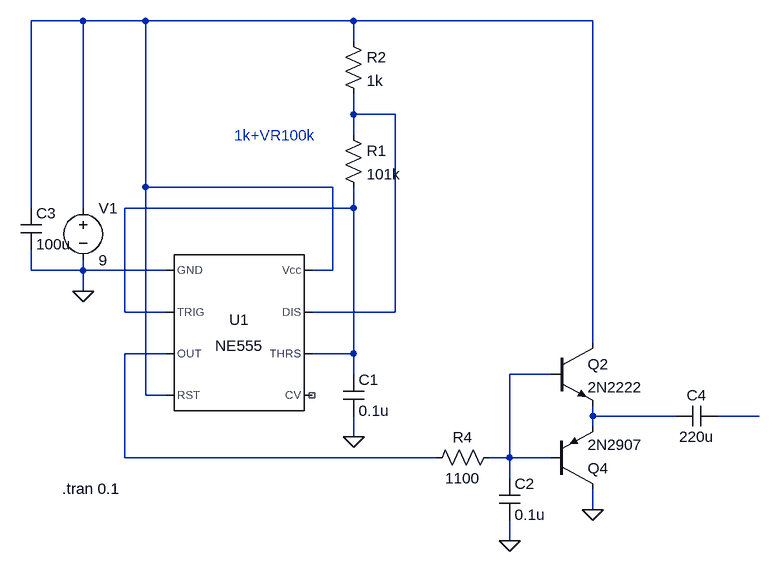
[diagram p0: schematic 555.asc]
555.asc, the LTspice schematic file:
Version 4
SHEET 1 1124 680
WIRE -48 -304 -128 -304
WIRE 48 -304 -48 -304
WIRE 368 -304 48 -304
WIRE 736 -304 368 -304
WIRE 368 -272 368 -304
WIRE 368 -160 368 -192
WIRE 432 -160 368 -160
WIRE 368 -128 368 -160
WIRE 48 -48 48 -304
WIRE 336 -48 48 -48
WIRE -128 -16 -128 -304
WIRE -48 -16 -48 -304
WIRE 368 -16 368 -48
WIRE 368 -16 16 -16
WIRE -128 80 -128 48
WIRE -48 80 -48 64
WIRE -48 80 -128 80
WIRE 80 80 -48 80
WIRE 336 80 336 -48
WIRE 336 80 304 80
WIRE -48 112 -48 80
WIRE 16 144 16 -16
WIRE 80 144 16 144
WIRE 432 144 432 -160
WIRE 432 144 304 144
WIRE 736 192 736 -304
WIRE 80 208 16 208
WIRE 368 208 368 -16
WIRE 368 208 304 208
WIRE 368 240 368 208
WIRE 672 240 608 240
WIRE 48 272 48 -48
WIRE 80 272 48 272
WIRE 736 304 736 288
WIRE 864 304 736 304
WIRE 992 304 928 304
WIRE 736 320 736 304
WIRE 368 336 368 304
WIRE 16 368 16 208
WIRE 496 368 16 368
WIRE 608 368 608 240
WIRE 608 368 576 368
WIRE 672 368 608 368
WIRE 608 400 608 368
WIRE 736 448 736 416
WIRE 608 496 608 464
FLAG 368 336 0
FLAG -48 112 0
FLAG 608 496 0
FLAG 736 448 0
SYMBOL Misc\\NE555 192 176 R0
SYMATTR InstName U1
SYMBOL res 352 -144 R0
SYMATTR InstName R1
SYMATTR Value 101k
SYMBOL cap 352 240 R0
SYMATTR InstName C1
SYMATTR Value 0.1u
SYMBOL voltage -48 -32 R0
WINDOW 123 0 0 Left 0
WINDOW 39 0 0 Left 0
SYMATTR InstName V1
SYMATTR Value 9
SYMBOL res 352 -288 R0
SYMATTR InstName R2
SYMATTR Value 1k
SYMBOL cap -144 -16 R0
SYMATTR InstName C3
SYMATTR Value 100u
SYMBOL res 592 352 R90
WINDOW 0 0 56 VBottom 2
WINDOW 3 32 56 VTop 2
SYMATTR InstName R4
SYMATTR Value 1100
SYMBOL cap 592 400 R0
SYMATTR InstName C2
SYMATTR Value 0.1u
SYMBOL npn 672 192 R0
SYMATTR InstName Q2
SYMATTR Value 2N2222
SYMBOL pnp 672 416 M180
SYMATTR InstName Q4
SYMATTR Value 2N2907
SYMBOL cap 928 288 R90
WINDOW 0 0 32 VBottom 2
WINDOW 3 32 32 VTop 2
SYMATTR InstName C4
SYMATTR Value 220u
TEXT -80 416 Left 2 !.tran 0.1
TEXT 184 -128 Left 2 ;1k+VR100k

The netlist it stands for:
* 555.asc
XU1 0 N003 N004 N001 NC_01 N003 N002 N001 NE555  ; pins GND TRIG OUT RST CV THRS DIS Vcc
R1 N002 N003 101k
C1 N003 0 0.1u
V1 N001 0 9
R2 N001 N002 1k
C3 N001 0 100u
R4 N005 N004 1100
C2 N005 0 0.1u
Q2 N001 N005 N006 0 2N2222
Q4 0 N005 N006 0 2N2907
C4 N007 N006 220u
.model NPN NPN
.model PNP PNP
.lib standard.bjt
.tran 0.1
* 1k+VR100k
.lib NE555.sub
.backanno
.end